# Altium schematic sheet Error Correcting For 7bit Hamming Code.SchDoc
size B; PART_NAME: epf10k50eqc208-3; Organization: Altium Limited; Address1: L3, 12a Rodborough Rd; Address2: Frenchs Forest; Address3: NSW; Address4: Australia 2086; DocumentNumber: 1; SheetNumber: 1; SheetTotal: 1
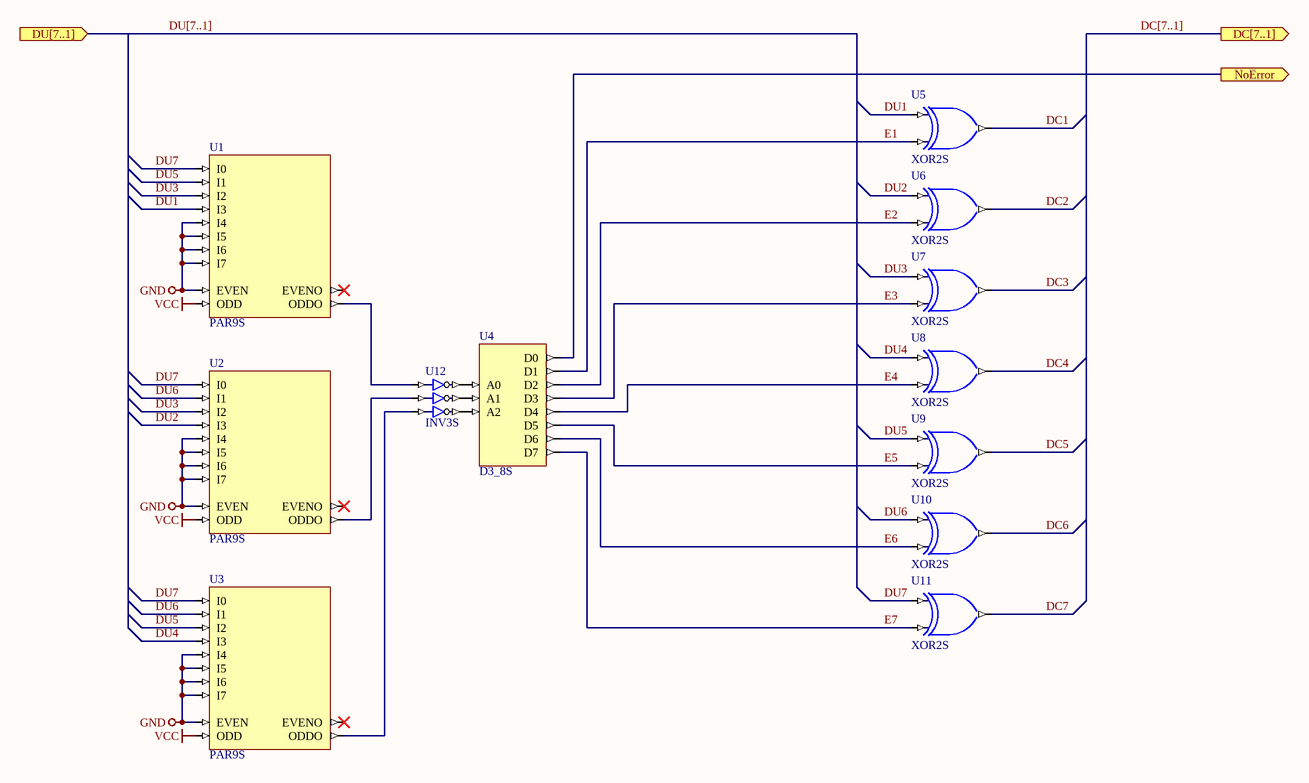
[diagram p0: Error Correcting For 7bit Hamming Code.SchDoc]

## Parts
U1  PAR9S
U2  PAR9S
U3  PAR9S
U4  D3_8S
U5  XOR2S
U6  XOR2S
U7  XOR2S
U8  XOR2S
U9  XOR2S
U10  XOR2S
U11  XOR2S
U12  INV3S

## Ports
DC[7..1] (out), DU[7..1] (in), NoError (out)

## Nets
GND: U1.EVEN U1.I4 U1.I5 U1.I6 U1.I7 U2.EVEN U2.I4 U2.I5 U2.I6 U2.I7 U3.EVEN U3.I4 U3.I5 U3.I6 U3.I7
VCC: U1.ODD U2.ODD U3.ODD
DC1: U5.O
DC2: U6.O
DC3: U7.O
DC4: U8.O
DC5: U9.O
DC6: U10.O
DC7: U11.O
DU1: U1.I3 U5.I0
DU2: U2.I3 U6.I0
DU3: U1.I2 U2.I2 U7.I0
DU4: U3.I3 U8.I0
DU5: U1.I1 U3.I2 U9.I0
DU6: U2.I1 U3.I1 U10.I0
DU7: U1.I0 U2.I0 U3.I0 U11.I0
E1: U4.D1 U5.I1
E2: U4.D2 U6.I1
E3: U4.D3 U7.I1
E4: U4.D4 U8.I1
E5: U4.D5 U9.I1
E6: U4.D6 U10.I1
E7: U4.D7 U11.I1
NoError: U4.D0 ; port NoError
NetU1_ODDO: U1.ODDO U12.I0
NetU2_ODDO: U2.ODDO U12.I1
NetU3_ODDO: U3.ODDO U12.I2
NetU4_A0: U4.A0 U12.O0
NetU4_A1: U4.A1 U12.O1
NetU4_A2: U4.A2 U12.O2

Not connected (* = marked no-connect by the designer): U1 EVENO*; U2 EVENO*; U3 EVENO*

## Buses and harness runs
bus DC[7..1] = port DC[7..1]
bus DU[7..1] = port DU[7..1]

## Notes on the sheet
- Title
- Size:
- Date:
- B
- Number:
- Time:
- Revision:
- Sheet
- of
- File:

## Library data of the parts
U1-U3 = PAR9S: 9-Bit Odd/Even Parity Generators/Checker, Single Pin Version; ArchiveName: GENERIC; VHDLIB_SIM: GENERIC_LIB; Published: 28-Jan-2004; Publisher: Altium Limited; Core Revision: 1.00.00
U4 = D3_8S: Binary 3- to 8-Bit Decoder, Single Pin Version; ArchiveName: GENERIC; VHDLIB_SIM: GENERIC_LIB; Published: 28-Jan-2004; Publisher: Altium Limited; Core Revision: 1.00.00
U5-U11 = XOR2S: 2-Input Exclusive-OR Gate, Single Pin Version; Xilinx Equivalent: XOR2; ArchiveName: GENERIC; VHDLIB_SIM: GENERIC_LIB; Published: 28-Jan-2004; Publisher: Altium Limited; Core Revision: 1.00.00
U12 = INV3S: 3-Bit Inverter, Single Pin Version; ArchiveName: GENERIC; VHDLIB_SIM: GENERIC_LIB; Published: 28-Jan-2004; Publisher: Altium Limited; Core Revision: 1.00.00